# Altium schematic sheet hole_field.SchDoc
size A4
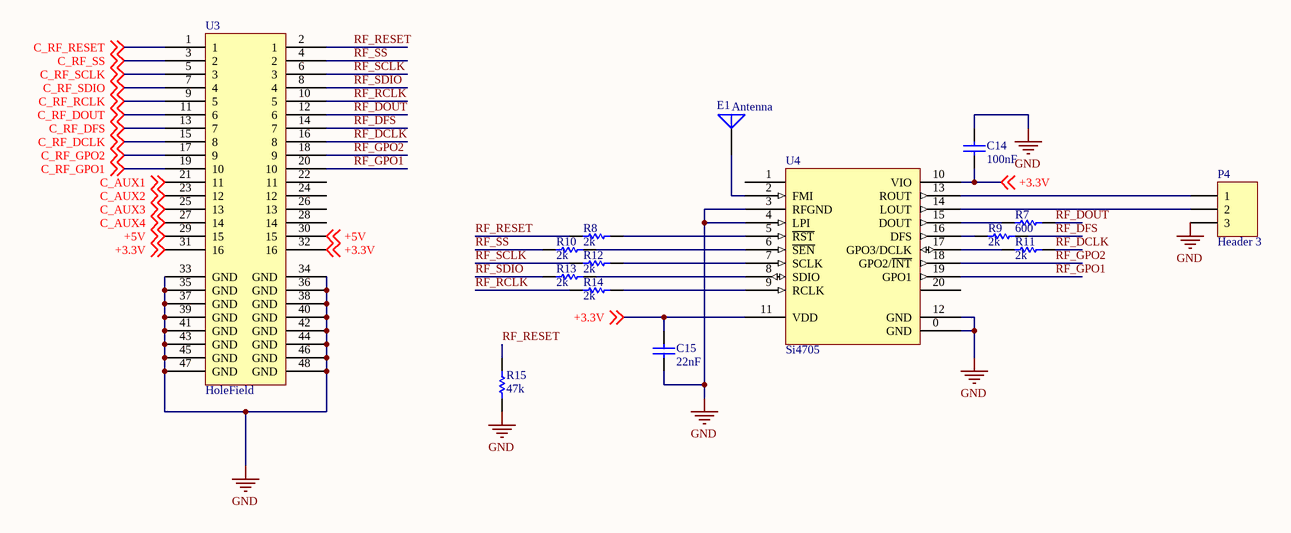
[diagram p0: hole_field.SchDoc]

## Parts
C14  100nF  [CHIP0805]
C15  22nF  [CHIP0805]
E1  Antenna  [PIN1]
P4  Header 3  [HDR1X3]
R7  600  [CHIP0805]
R8  2k  [CHIP0805]
R9  2k  [CHIP0805]
R10  2k  [CHIP0805]
R11  2k  [CHIP0805]
R12  2k  [CHIP0805]
R13  2k  [CHIP0805]
R14  2k  [CHIP0805]
R15  47k  [CHIP0805]
U3  HoleField  [HoleField]
U4  Si4705  [QFN50P300X300X60-20N]

## Nets
GND: C14.2 C15.1 P4.3 R15.1 U3.33(GND) U3.34(GND) U3.35(GND) U3.36(GND) U3.37(GND) U3.38(GND) U3.39(GND) U3.40(GND) U3.41(GND) U3.42(GND) U3.43(GND) U3.44(GND) U3.45(GND) U3.46(GND) U3.47(GND) U3.48(GND) U4.0(GND) U4.3(RFGND) U4.4(LPI) U4.12(GND)
+3.3V: C14.1 C15.2 U3.31(16) U3.32(16) U4.10(VIO) U4.11(VDD) ; off-sheet +3.3V
+5V: U3.29(15) U3.30(15) ; off-sheet +5V
C_AUX1: U3.21(11) ; off-sheet C_AUX1
C_AUX2: U3.23(12) ; off-sheet C_AUX2
C_AUX3: U3.25(13) ; off-sheet C_AUX3
C_AUX4: U3.27(14) ; off-sheet C_AUX4
C_RF_DCLK: U3.15(8) ; off-sheet C_RF_DCLK
C_RF_DFS: U3.13(7) ; off-sheet C_RF_DFS
C_RF_DOUT: U3.11(6) ; off-sheet C_RF_DOUT
C_RF_GPO1: U3.19(10) ; off-sheet C_RF_GPO1
C_RF_GPO2: U3.17(9) ; off-sheet C_RF_GPO2
C_RF_RCLK: U3.9(5) ; off-sheet C_RF_RCLK
C_RF_RESET: U3.1 ; off-sheet C_RF_RESET
C_RF_SCLK: U3.5(3) ; off-sheet C_RF_SCLK
C_RF_SDIO: U3.7(4) ; off-sheet C_RF_SDIO
C_RF_SS: U3.3(2) ; off-sheet C_RF_SS
RF_DCLK: R11.2 U3.16(8)
RF_DFS: R9.2 U3.14(7)
RF_DOUT: R7.2 U3.12(6)
RF_GPO1: U3.20(10) U4.19(GPO1)
RF_GPO2: U3.18(9) U4.18(GPO2/~{INT})
RF_RCLK: R14.1 U3.10(5)
RF_RESET: R8.1 R15.2 U3.2(1)
RF_~{SS}: R10.1 U3.4(2)
RF_SCLK: R12.1 U3.6(3)
RF_SDIO: R13.1 U3.8(4)
NetE1_1: E1.1(A) U4.2(FMI)
NetP4_1: P4.1 U4.13(ROUT)
NetP4_2: P4.2 U4.14(LOUT)
NetR7_1: R7.1 U4.15(DOUT)
NetR8_2: R8.2 U4.5(~{RST})
NetR9_1: R9.1 U4.16(DFS)
NetR10_2: R10.2 U4.6(~{SEN})
NetR11_1: R11.1 U4.17(GPO3/DCLK)
NetR12_2: R12.2 U4.7(SCLK)
NetR13_2: R13.2 U4.8(SDIO)
NetR14_2: R14.2 U4.9(RCLK)

Not connected (* = marked no-connect by the designer): U3 22(11) 24(12) 26(13) 28(14); U4 1(NC) 20(NC)

## Library data of the parts
C14 C15 = Cap: Capacitor; Published: 8-Jun-2000; LatestRevisionDate: 17-Jul-2002; LatestRevisionNote: Re-released for DXP Platform.; PackageReference: RAD-0.3; Publisher: Altium Limited
  C14: Value: 100nF
  C15: Value: 22nF
E1 = Antenna: Generic Antenna; Published: 24-Mar-1999; LatestRevisionDate: 17-Jul-2002; LatestRevisionNote: Re-released for DXP Platform.; PackageReference: PIN1; Publisher: Altium Limited
P4 = Header 3: Header, 3-Pin; LatestRevisionDate: 17-Jul-2002; LatestRevisionNote: Re-released for DXP Platform.; Publisher: Altium Limited
R7-R15 = Res1: Resistor; Published: 8-Jun-2000; LatestRevisionDate: 17-Jul-2002; LatestRevisionNote: Re-released for DXP Platform.; PackageReference: AXIAL-0.3; Publisher: Altium Limited
  R7: Value: 600
  R8-R14: Value: 2k
  R15: Value: 47k